# Altium schematic sheet 3.3VDC 250mA Linear PS.SchDoc: Title
size A4; Date: Date; CheckedBy: Checked By; SheetNumber: x; SheetTotal: y; DesignedBy: Designed By
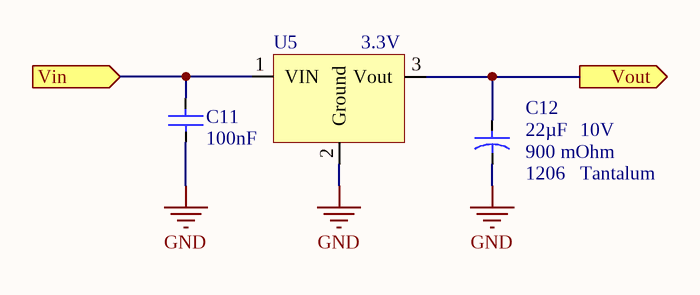
[diagram p0: 3.3VDC 250mA Linear PS.SchDoc]

## Parts
C11  Capacitance: 100nF  [Capacitor - 0603 Ceramic]  (hidden comment: 100nF 0603 50V)
C12  ESR (Equivalent Series Resistance): 900 mOhm  Voltage - Rated: 10V  Package / Case: 1206  Capacitance: 22µF  Material: Tantalum
U5  Voltage - Output: 3.3V  [SOT223-3]  (hidden comment: 3.3VDC 1A Linear Regulator)

## Ports
Vin (in), Vout (out)

## Nets
GND: C11.2 C12.2 U5.2(Ground)
Vin: C11.1 U5.1(VIN) ; port Vin
Vout: C12.1 U5.3(Vout) ; port Vout

## Notes on the sheet
- Repository Version
- BOM/Variant

## Library data of the parts
C11 = 100nF 0603 50V: Non-polarized; Manufacturer: Murata Electronics North America; Manufacturer Part Number: GRM188R71H104KA93D; Value: 100 nF 50V 0603 XR7 10%; Tolerance: ±10%; Temperature Coefficient: X7R; Technology: SMT; Supplier 1: Digi-Key; Supplier Part Number 1: 490-1519-1-ND; RoHS: RoHS Compliant; Category: Capacitors; Stock 1: 4132110; Pricing 1: 1=0.12, 10=0.048, 50=0.0256, 100=0.0218, 250=0.01776, 500=0.0152, 1000=0.01185 (CAD); Packaging: Cut Tape (CT); Voltage - Rated: 50V; Mounting Type: Surface Mount, MLCC; Operating Temperature: -55°C ~ 125°C; Applications: General Purpose; Ratings: -; Package / Case: 0603 (1608 Metric); Size / Dimension: 0.063" L x 0.031" W (1.60mm x 0.80mm); Height - Seated (Max): -; Thickness (Max): 0.035" (0.90mm); Lead Spacing: -; Features: -; Lead Style: -; ComponentLink1URL: http://www.murata.com/products/catalog/pdf/c02e.pdf; ComponentLink1Description: Spec Sheet
C12 = 22uF 1206 10V - Tantalum: Polarized; Manufacturer: AVX Corporation; Manufacturer Part Number: TPSA226M010R0900; Manufacturer Size Code: A; Tolerance: ±20%; Type: Molded; Value: 22uF 1206 10V - Tantalum; Supplier 1: Digi-Key; RoHS: RoHS Compliant; Category: Capacitors; Stock 1: 13605; Pricing 1: 1=0.77, 10=0.567, 100=0.3889, 500=0.30788, 1000=0.25927 (USD); Packaging: Cut Tape (CT); Part Status: Active; Operating Temperature: -55°C ~ 125°C; Lifetime @ Temp.: -; Mounting Type: Surface Mount; Size / Dimension: 0.126" L x 0.063" W (3.20mm x 1.60mm); Height - Seated (Max): 0.071" (1.80mm); Lead Spacing: -; Features: General Purpose; Failure Rate: -; ComponentLink1URL: http://datasheets.avx.com/TPS.pdf; ComponentLink1Description: Spec Sheet; Supplier Part Number 1: 478-9039-1-ND
U5 = 3.3VDC 1A Linear Regulator: Manufacturer: Microchip Technology; Manufacturer Part Number: MCP1826S-3302E/DB; Regulator Topology: Positive Fixed; Voltage - Dropout (Typical): 0.25V @ 1A; Number of Regulators: 1; Voltage - Input: Up to 6V; Value: 3.3VDC 1A Linear Regulator; Supplier 1: Digi-Key; Supplier Part Number 1: MCP1826S-3302E/DB-ND; RoHS: RoHS Compliant; Category: Integrated Circuits (ICs); Stock 1: 7009; Pricing 1: 1=0.82, 10=0.68, 25=0.57, 100=0.52 (USD); Packaging: Tube; Current - Output: 1A; Current - Limit (Min): -; Operating Temperature: -40°C ~ 125°C; Mounting Type: Surface Mount; Package / Case: TO-261-4, TO-261AA; Supplier Device Package: SOT-223-3; ComponentLink1URL: http://www.microchip.com/mymicrochip/filehandler.aspx?ddocname=en531701; ComponentLink1Description: Spec Sheet